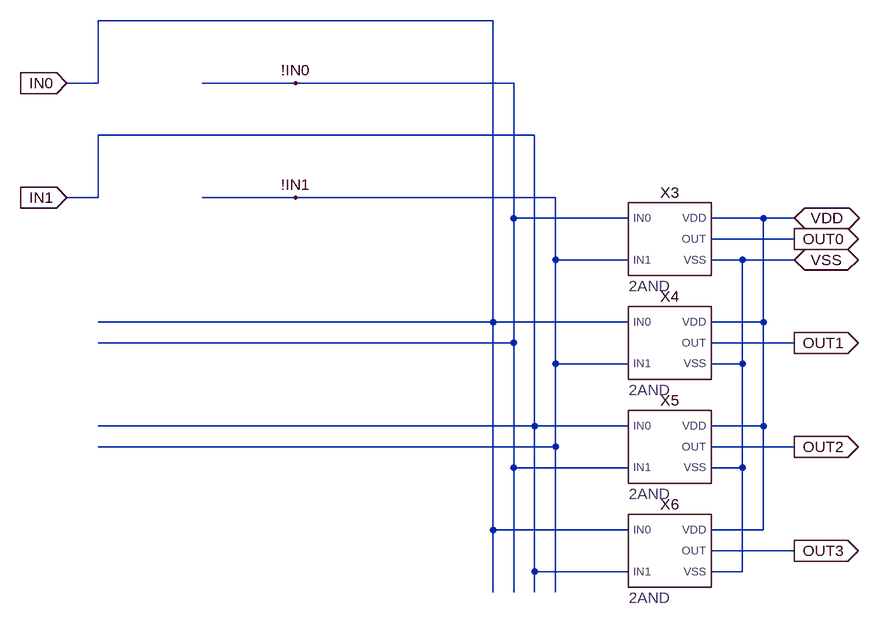
[diagram p0: schematic 4BTO4D.asc]
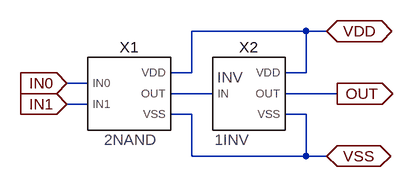
[diagram p1: sub-circuit 2and.asc]
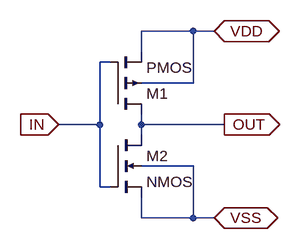
[diagram p2: sub-circuit 1inv.asc]
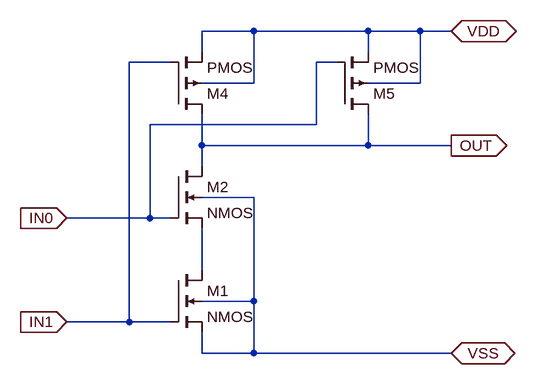
[diagram p3: sub-circuit 2nand.asc]
4BTO4D.asc, the LTspice schematic file:
Version 4
SHEET 1 880 680
WIRE 16 -320 -592 -320
WIRE -592 -224 -592 -320
WIRE -592 -224 -640 -224
WIRE -288 -224 -432 -224
WIRE 48 -224 -288 -224
WIRE 80 -144 -592 -144
WIRE -592 -48 -592 -144
WIRE -592 -48 -640 -48
WIRE -288 -48 -432 -48
WIRE 112 -48 -288 -48
WIRE 48 -16 48 -224
WIRE 224 -16 48 -16
WIRE 432 -16 352 -16
WIRE 480 -16 432 -16
WIRE 480 16 352 16
WIRE 112 48 112 -48
WIRE 224 48 112 48
WIRE 400 48 352 48
WIRE 480 48 400 48
WIRE 16 144 16 -320
WIRE 16 144 -592 144
WIRE 224 144 16 144
WIRE 432 144 432 -16
WIRE 432 144 352 144
WIRE 48 176 48 -16
WIRE 48 176 -592 176
WIRE 480 176 352 176
WIRE 112 208 112 48
WIRE 224 208 112 208
WIRE 400 208 400 48
WIRE 400 208 352 208
WIRE 80 304 80 -144
WIRE 80 304 -592 304
WIRE 224 304 80 304
WIRE 432 304 432 144
WIRE 432 304 352 304
WIRE 112 336 112 208
WIRE 112 336 -592 336
WIRE 480 336 352 336
WIRE 48 368 48 176
WIRE 224 368 48 368
WIRE 400 368 400 208
WIRE 400 368 352 368
WIRE 16 464 16 144
WIRE 224 464 16 464
WIRE 432 464 432 304
WIRE 432 464 352 464
WIRE 480 496 352 496
WIRE 80 528 80 304
WIRE 224 528 80 528
WIRE 400 528 400 368
WIRE 400 528 352 528
WIRE 16 560 16 464
WIRE 48 560 48 368
WIRE 80 560 80 528
WIRE 112 560 112 336
FLAG -640 -224 IN0
IOPIN -640 -224 In
FLAG -640 -48 IN1
IOPIN -640 -48 In
FLAG -288 -224 !IN0
FLAG -288 -48 !IN1
FLAG 480 -16 VDD
IOPIN 480 -16 BiDir
FLAG 480 48 VSS
IOPIN 480 48 BiDir
FLAG 480 16 OUT0
IOPIN 480 16 Out
FLAG 480 176 OUT1
IOPIN 480 176 Out
FLAG 480 336 OUT2
IOPIN 480 336 Out
FLAG 480 496 OUT3
IOPIN 480 496 Out
SYMBOL 2AND 288 16 R0
SYMATTR InstName X3
SYMBOL 2AND 288 176 R0
SYMATTR InstName X4
SYMBOL 2AND 288 336 R0
SYMATTR InstName X5
SYMBOL 2AND 288 496 R0
SYMATTR InstName X6

2and.asc, the sub-circuit schematic file:
Version 4
SHEET 1 1048 680
WIRE 656 -32 480 -32
WIRE 688 -32 656 -32
WIRE 480 32 480 -32
WIRE 480 32 448 32
WIRE 656 32 656 -32
WIRE 656 32 624 32
WIRE 320 48 288 48
WIRE 512 64 448 64
WIRE 704 64 624 64
WIRE 320 80 288 80
WIRE 480 96 448 96
WIRE 656 96 624 96
WIRE 480 160 480 96
WIRE 656 160 656 96
WIRE 656 160 480 160
WIRE 688 160 656 160
FLAG 704 64 OUT
IOPIN 704 64 Out
FLAG 688 -32 VDD
IOPIN 688 -32 BiDir
FLAG 688 160 VSS
IOPIN 688 160 BiDir
FLAG 288 48 IN0
IOPIN 288 48 In
FLAG 288 80 IN1
IOPIN 288 80 In
SYMBOL 1INV 560 64 R0
SYMATTR InstName X2
SYMBOL 2NAND 384 64 R0
SYMATTR InstName X1

1inv.asc, the sub-circuit schematic file:
Version 4
SHEET 1 880 680
WIRE 224 -16 144 -16
WIRE 256 -16 224 -16
WIRE 144 16 144 -16
WIRE 96 32 80 32
WIRE 224 64 224 -16
WIRE 224 64 144 64
WIRE 80 128 80 32
WIRE 80 128 16 128
WIRE 144 128 144 112
WIRE 272 128 144 128
WIRE 144 144 144 128
WIRE 224 192 144 192
WIRE 80 224 80 128
WIRE 96 224 80 224
WIRE 144 272 144 240
WIRE 224 272 224 192
WIRE 224 272 144 272
WIRE 256 272 224 272
FLAG 16 128 IN
IOPIN 16 128 In
FLAG 272 128 OUT
IOPIN 272 128 Out
FLAG 256 -16 VDD
IOPIN 256 -16 BiDir
FLAG 256 272 VSS
IOPIN 256 272 BiDir
SYMBOL pmos4 96 112 M180
SYMATTR InstName M1
SYMATTR Value2 l=110nM w=180nM
SYMBOL nmos4 96 144 R0
SYMATTR InstName M2
SYMATTR Value2 l=110nM w=180nM

2nand.asc, the sub-circuit schematic file:
Version 4
SHEET 1 880 680
WIRE 224 -224 144 -224
WIRE 400 -224 224 -224
WIRE 480 -224 400 -224
WIRE 528 -224 480 -224
WIRE 144 -192 144 -224
WIRE 400 -192 400 -224
WIRE 96 -176 32 -176
WIRE 352 -176 320 -176
WIRE 224 -144 224 -224
WIRE 224 -144 144 -144
WIRE 480 -144 480 -224
WIRE 480 -144 400 -144
WIRE 320 -80 320 -176
WIRE 320 -80 64 -80
WIRE 144 -48 144 -96
WIRE 400 -48 400 -96
WIRE 400 -48 144 -48
WIRE 528 -48 400 -48
WIRE 144 -16 144 -48
WIRE 224 32 144 32
WIRE 64 64 64 -80
WIRE 64 64 -64 64
WIRE 96 64 64 64
WIRE 144 144 144 80
WIRE 224 192 224 32
WIRE 224 192 144 192
WIRE 32 224 32 -176
WIRE 32 224 -64 224
WIRE 96 224 32 224
WIRE 144 272 144 240
WIRE 224 272 224 192
WIRE 224 272 144 272
WIRE 528 272 224 272
FLAG 528 -224 VDD
IOPIN 528 -224 BiDir
FLAG 528 272 VSS
IOPIN 528 272 BiDir
FLAG -64 64 IN0
IOPIN -64 64 In
FLAG -64 224 IN1
IOPIN -64 224 In
FLAG 528 -48 OUT
IOPIN 528 -48 Out
SYMBOL nmos4 96 144 R0
SYMATTR InstName M1
SYMATTR Value2 l=110n w=180n
SYMBOL nmos4 96 -16 R0
SYMATTR InstName M2
SYMATTR Value2 l=110n w=180n
SYMBOL pmos4 96 -96 M180
SYMATTR InstName M4
SYMATTR Value2 l=110n w=180n
SYMBOL pmos4 352 -96 M180
SYMATTR InstName M5
SYMATTR Value2 l=110n w=180n

The netlist it stands for:
* 4BTO4D.asc
XX3 !IN0 !IN1 OUT0 VDD VSS 2and
XX4 IN0 !IN1 OUT1 VDD VSS 2and
XX5 IN1 !IN0 OUT2 VDD VSS 2and
XX6 IN0 IN1 OUT3 VDD VSS 2and

* block symbol definitions
.subckt 2and IN0 IN1 OUT VDD VSS
XX2 N001 OUT VDD VSS 1inv
XX1 IN0 IN1 N001 VDD VSS 2nand
.ends 2and

.subckt 1inv IN OUT VDD VSS
M1 OUT IN VDD VDD PMOS l=110nM w=180nM
M2 OUT IN VSS VSS NMOS l=110nM w=180nM
.ends 1inv

.subckt 2nand IN0 IN1 OUT VDD VSS
M1 N001 IN1 VSS VSS NMOS l=110n w=180n
M2 OUT IN0 N001 VSS NMOS l=110n w=180n
M4 OUT IN1 VDD VDD PMOS l=110n w=180n
M5 OUT IN0 VDD VDD PMOS l=110n w=180n
.ends 2nand

.model NMOS NMOS
.model PMOS PMOS
.lib standard.mos
.backanno
.end